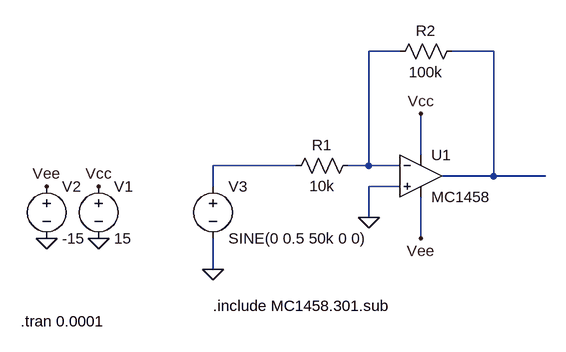
[diagram p0: schematic kadai1.asc]
kadai1.asc, the LTspice schematic file:
Version 4
SHEET 1 880 680
WIRE 592 -64 544 -64
WIRE 736 -64 672 -64
WIRE 624 96 624 32
WIRE 432 112 304 112
WIRE 544 112 544 -64
WIRE 544 112 512 112
WIRE 592 112 544 112
WIRE 736 128 736 -64
WIRE 736 128 656 128
WIRE 816 128 736 128
WIRE 304 144 304 112
WIRE 592 144 544 144
WIRE 544 192 544 144
WIRE 624 224 624 160
WIRE 304 272 304 224
FLAG 48 224 0
FLAG 128 224 0
FLAG 128 144 Vcc
FLAG 48 144 Vee
FLAG 304 272 0
FLAG 624 32 Vcc
FLAG 624 224 Vee
FLAG 544 192 0
SYMBOL voltage 128 128 R0
SYMATTR InstName V1
SYMATTR Value 15
SYMBOL voltage 48 128 R0
SYMATTR InstName V2
SYMATTR Value -15
SYMBOL voltage 304 128 R0
WINDOW 123 0 0 Left 0
WINDOW 39 0 0 Left 0
SYMATTR InstName V3
SYMATTR Value SINE(0 0.5 50k 0 0)
SYMBOL res 528 96 R90
WINDOW 0 0 56 VBottom 2
WINDOW 3 32 56 VTop 2
SYMATTR InstName R1
SYMATTR Value 10k
SYMBOL res 688 -80 R90
WINDOW 0 0 56 VBottom 2
WINDOW 3 32 56 VTop 2
SYMATTR InstName R2
SYMATTR Value 100k
SYMBOL OpAmps\\opamp2 624 64 R0
SYMATTR InstName U1
SYMATTR Value MC1458
TEXT 304 328 Left 2 !.include MC1458.301.sub
TEXT 8 352 Left 2 !.tran 0.0001

The netlist it stands for:
* kadai1.asc
V1 Vcc 0 15
V2 Vee 0 -15
V3 N003 0 SINE(0 0.5 50k 0 0)
R1 N001 N003 10k
R2 N002 N001 100k
XU1 0 N001 Vcc Vee N002 MC1458  ; pins In+ In- V+ V- OUT
.include MC1458.301.sub
.tran 0.0001
.backanno
.end